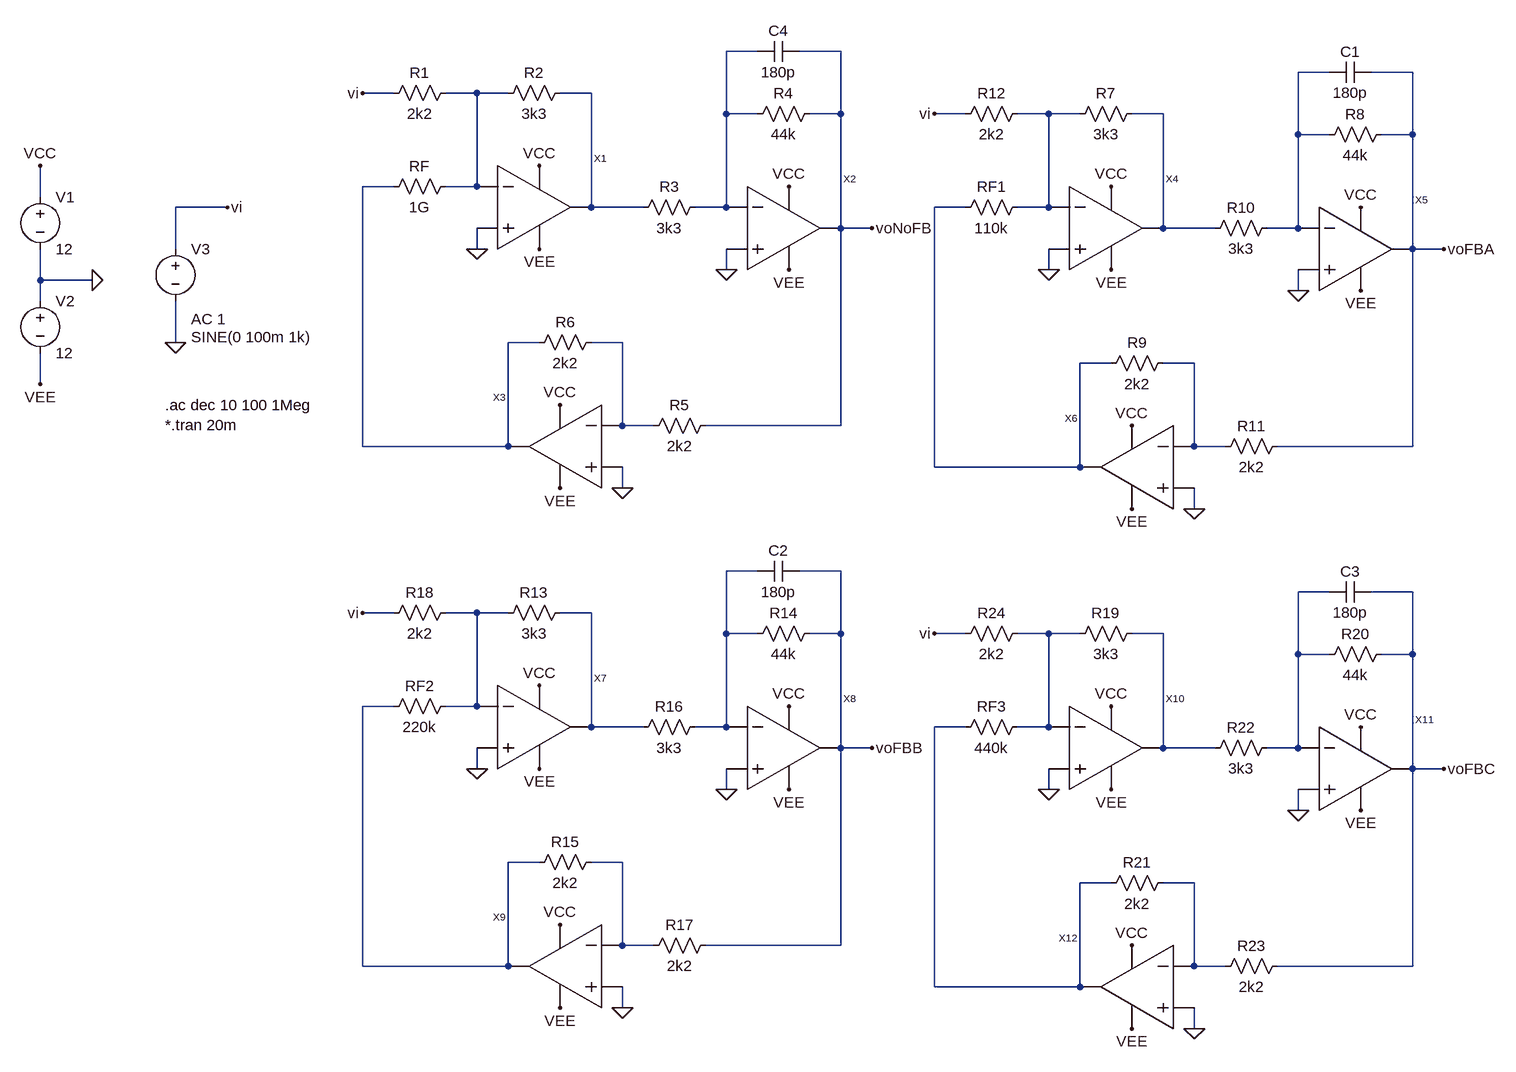
[diagram p0: schematic Perc-02-01-gabung.asc]
Perc-02-01-gabung.asc, the LTspice schematic file:
Version 4
SHEET 1 2268 1400
WIRE 1120 -192 1072 -192
WIRE 1248 -192 1184 -192
WIRE 2000 -160 1952 -160
WIRE 2128 -160 2064 -160
WIRE 560 -128 512 -128
WIRE 688 -128 640 -128
WIRE 736 -128 688 -128
WIRE 864 -128 816 -128
WIRE 1072 -96 1072 -192
WIRE 1120 -96 1072 -96
WIRE 1248 -96 1248 -192
WIRE 1248 -96 1200 -96
WIRE 1440 -96 1392 -96
WIRE 1568 -96 1520 -96
WIRE 1616 -96 1568 -96
WIRE 1744 -96 1696 -96
WIRE 1952 -64 1952 -160
WIRE 2000 -64 1952 -64
WIRE 2128 -64 2128 -160
WIRE 2128 -64 2080 -64
WIRE 560 16 512 16
WIRE 688 16 688 -128
WIRE 688 16 640 16
WIRE 16 32 16 -16
WIRE 304 48 224 48
WIRE 864 48 864 -128
WIRE 944 48 864 48
WIRE 1072 48 1072 -96
WIRE 1072 48 1024 48
WIRE 1440 48 1392 48
WIRE 1568 48 1568 -96
WIRE 1568 48 1520 48
WIRE 1248 80 1248 -96
WIRE 1248 80 1232 80
WIRE 1296 80 1248 80
WIRE 1744 80 1744 -96
WIRE 1824 80 1744 80
WIRE 1952 80 1952 -64
WIRE 1952 80 1904 80
WIRE 224 112 224 48
WIRE 688 112 688 80
WIRE 2128 112 2128 -64
WIRE 2128 112 2112 112
WIRE 2176 112 2128 112
WIRE 1072 144 1072 112
WIRE 1568 144 1568 112
WIRE 16 160 16 112
WIRE 96 160 16 160
WIRE 1952 176 1952 144
WIRE 16 192 16 160
WIRE 224 256 224 192
WIRE 784 256 736 256
WIRE 912 256 864 256
WIRE 1664 288 1616 288
WIRE 1792 288 1744 288
WIRE 16 320 16 272
WIRE 912 384 912 256
WIRE 960 384 912 384
WIRE 1248 384 1248 80
WIRE 1248 384 1040 384
WIRE 512 416 512 16
WIRE 736 416 736 256
WIRE 736 416 512 416
WIRE 1792 416 1792 288
WIRE 1840 416 1792 416
WIRE 2128 416 2128 112
WIRE 2128 416 1920 416
WIRE 1392 448 1392 48
WIRE 1616 448 1616 288
WIRE 1616 448 1392 448
WIRE 912 480 912 448
WIRE 1792 512 1792 480
WIRE 1120 608 1072 608
WIRE 1248 608 1184 608
WIRE 2000 640 1952 640
WIRE 2128 640 2064 640
WIRE 560 672 512 672
WIRE 688 672 640 672
WIRE 736 672 688 672
WIRE 864 672 816 672
WIRE 1072 704 1072 608
WIRE 1120 704 1072 704
WIRE 1248 704 1248 608
WIRE 1248 704 1200 704
WIRE 1440 704 1392 704
WIRE 1568 704 1520 704
WIRE 1616 704 1568 704
WIRE 1744 704 1696 704
WIRE 1952 736 1952 640
WIRE 2000 736 1952 736
WIRE 2128 736 2128 640
WIRE 2128 736 2080 736
WIRE 560 816 512 816
WIRE 688 816 688 672
WIRE 688 816 640 816
WIRE 864 848 864 672
WIRE 944 848 864 848
WIRE 1072 848 1072 704
WIRE 1072 848 1024 848
WIRE 1440 848 1392 848
WIRE 1568 848 1568 704
WIRE 1568 848 1520 848
WIRE 1248 880 1248 704
WIRE 1248 880 1232 880
WIRE 1296 880 1248 880
WIRE 1744 880 1744 704
WIRE 1824 880 1744 880
WIRE 1952 880 1952 736
WIRE 1952 880 1904 880
WIRE 688 912 688 880
WIRE 2128 912 2128 736
WIRE 2128 912 2112 912
WIRE 2176 912 2128 912
WIRE 1072 944 1072 912
WIRE 1568 944 1568 912
WIRE 1952 976 1952 944
WIRE 784 1056 736 1056
WIRE 912 1056 864 1056
WIRE 1664 1088 1616 1088
WIRE 1792 1088 1744 1088
WIRE 912 1184 912 1056
WIRE 960 1184 912 1184
WIRE 1248 1184 1248 880
WIRE 1248 1184 1040 1184
WIRE 512 1216 512 816
WIRE 736 1216 736 1056
WIRE 736 1216 512 1216
WIRE 1792 1216 1792 1088
WIRE 1840 1216 1792 1216
WIRE 2128 1216 2128 912
WIRE 2128 1216 1920 1216
WIRE 1392 1248 1392 848
WIRE 1616 1248 1616 1088
WIRE 1616 1248 1392 1248
WIRE 912 1280 912 1248
WIRE 1792 1312 1792 1280
FLAG 16 -16 VCC
FLAG 16 320 VEE
FLAG 96 160 0
FLAG 784 -16 VCC
FLAG 1168 16 VCC
FLAG 816 352 VCC
FLAG 816 480 VEE
FLAG 784 112 VEE
FLAG 1168 144 VEE
FLAG 688 112 0
FLAG 1072 144 0
FLAG 912 480 0
FLAG 1296 80 voNoFB
FLAG 512 -128 vi
FLAG 304 48 vi
FLAG 224 256 0
FLAG 1664 16 VCC
FLAG 2048 48 VCC
FLAG 1696 384 VCC
FLAG 1696 512 VEE
FLAG 1664 144 VEE
FLAG 2048 176 VEE
FLAG 1568 144 0
FLAG 1952 176 0
FLAG 1792 512 0
FLAG 2176 112 voFBA
FLAG 1392 -96 vi
FLAG 784 784 VCC
FLAG 1168 816 VCC
FLAG 816 1152 VCC
FLAG 816 1280 VEE
FLAG 784 912 VEE
FLAG 1168 944 VEE
FLAG 688 912 0
FLAG 1072 944 0
FLAG 912 1280 0
FLAG 1296 880 voFBB
FLAG 512 672 vi
FLAG 1664 816 VCC
FLAG 2048 848 VCC
FLAG 1696 1184 VCC
FLAG 1696 1312 VEE
FLAG 1664 944 VEE
FLAG 2048 976 VEE
FLAG 1568 944 0
FLAG 1952 976 0
FLAG 1792 1312 0
FLAG 2176 912 voFBC
FLAG 1392 704 vi
SYMBOL voltage 16 16 R0
SYMATTR InstName V1
SYMATTR Value 12
SYMBOL voltage 16 176 R0
SYMATTR InstName V2
SYMATTR Value 12
SYMBOL Opampku 768 48 R0
SYMATTR InstName X1
SYMBOL Opampku 1152 80 R0
SYMATTR InstName X2
SYMBOL Opampku 832 416 M0
SYMATTR InstName X3
SYMBOL res 832 -144 R90
WINDOW 0 0 56 VBottom 2
WINDOW 3 32 56 VTop 2
SYMATTR InstName R2
SYMATTR Value 3k3
SYMBOL res 1216 -112 R90
WINDOW 0 0 56 VBottom 2
WINDOW 3 32 56 VTop 2
SYMATTR InstName R4
SYMATTR Value 44k
SYMBOL res 880 240 R90
WINDOW 0 0 56 VBottom 2
WINDOW 3 32 56 VTop 2
SYMATTR InstName R6
SYMATTR Value 2k2
SYMBOL res 656 0 R90
WINDOW 0 0 56 VBottom 2
WINDOW 3 32 56 VTop 2
SYMATTR InstName RF
SYMATTR Value 1G
SYMBOL res 1040 32 R90
WINDOW 0 0 56 VBottom 2
WINDOW 3 32 56 VTop 2
SYMATTR InstName R3
SYMATTR Value 3k3
SYMBOL res 1056 368 R90
WINDOW 0 0 56 VBottom 2
WINDOW 3 32 56 VTop 2
SYMATTR InstName R5
SYMATTR Value 2k2
SYMBOL res 656 -144 R90
WINDOW 0 0 56 VBottom 2
WINDOW 3 32 56 VTop 2
SYMATTR InstName R1
SYMATTR Value 2k2
SYMBOL cap 1184 -208 R90
WINDOW 0 0 32 VBottom 2
WINDOW 3 32 32 VTop 2
SYMATTR InstName C4
SYMATTR Value 180p
SYMBOL voltage 224 96 R0
WINDOW 3 24 152 Left 2
WINDOW 123 24 124 Left 2
WINDOW 39 0 0 Left 0
SYMATTR Value SINE(0 100m 1k)
SYMATTR Value2 AC 1
SYMATTR InstName V3
SYMBOL Opampku 1648 80 R0
SYMATTR InstName X4
SYMBOL Opampku 2032 112 R0
SYMATTR InstName X5
SYMBOL Opampku 1712 448 M0
SYMATTR InstName X6
SYMBOL res 1712 -112 R90
WINDOW 0 0 56 VBottom 2
WINDOW 3 32 56 VTop 2
SYMATTR InstName R7
SYMATTR Value 3k3
SYMBOL res 2096 -80 R90
WINDOW 0 0 56 VBottom 2
WINDOW 3 32 56 VTop 2
SYMATTR InstName R8
SYMATTR Value 44k
SYMBOL res 1760 272 R90
WINDOW 0 0 56 VBottom 2
WINDOW 3 32 56 VTop 2
SYMATTR InstName R9
SYMATTR Value 2k2
SYMBOL res 1536 32 R90
WINDOW 0 0 56 VBottom 2
WINDOW 3 32 56 VTop 2
SYMATTR InstName RF1
SYMATTR Value 110k
SYMBOL res 1920 64 R90
WINDOW 0 0 56 VBottom 2
WINDOW 3 32 56 VTop 2
SYMATTR InstName R10
SYMATTR Value 3k3
SYMBOL res 1936 400 R90
WINDOW 0 0 56 VBottom 2
WINDOW 3 32 56 VTop 2
SYMATTR InstName R11
SYMATTR Value 2k2
SYMBOL res 1536 -112 R90
WINDOW 0 0 56 VBottom 2
WINDOW 3 32 56 VTop 2
SYMATTR InstName R12
SYMATTR Value 2k2
SYMBOL cap 2064 -176 R90
WINDOW 0 0 32 VBottom 2
WINDOW 3 32 32 VTop 2
SYMATTR InstName C1
SYMATTR Value 180p
SYMBOL Opampku 768 848 R0
SYMATTR InstName X7
SYMBOL Opampku 1152 880 R0
SYMATTR InstName X8
SYMBOL Opampku 832 1216 M0
SYMATTR InstName X9
SYMBOL res 832 656 R90
WINDOW 0 0 56 VBottom 2
WINDOW 3 32 56 VTop 2
SYMATTR InstName R13
SYMATTR Value 3k3
SYMBOL res 1216 688 R90
WINDOW 0 0 56 VBottom 2
WINDOW 3 32 56 VTop 2
SYMATTR InstName R14
SYMATTR Value 44k
SYMBOL res 880 1040 R90
WINDOW 0 0 56 VBottom 2
WINDOW 3 32 56 VTop 2
SYMATTR InstName R15
SYMATTR Value 2k2
SYMBOL res 656 800 R90
WINDOW 0 0 56 VBottom 2
WINDOW 3 32 56 VTop 2
SYMATTR InstName RF2
SYMATTR Value 220k
SYMBOL res 1040 832 R90
WINDOW 0 0 56 VBottom 2
WINDOW 3 32 56 VTop 2
SYMATTR InstName R16
SYMATTR Value 3k3
SYMBOL res 1056 1168 R90
WINDOW 0 0 56 VBottom 2
WINDOW 3 32 56 VTop 2
SYMATTR InstName R17
SYMATTR Value 2k2
SYMBOL res 656 656 R90
WINDOW 0 0 56 VBottom 2
WINDOW 3 32 56 VTop 2
SYMATTR InstName R18
SYMATTR Value 2k2
SYMBOL cap 1184 592 R90
WINDOW 0 0 32 VBottom 2
WINDOW 3 32 32 VTop 2
SYMATTR InstName C2
SYMATTR Value 180p
SYMBOL Opampku 1648 880 R0
SYMATTR InstName X10
SYMBOL Opampku 2032 912 R0
SYMATTR InstName X11
SYMBOL Opampku 1712 1248 M0
SYMATTR InstName X12
SYMBOL res 1712 688 R90
WINDOW 0 0 56 VBottom 2
WINDOW 3 32 56 VTop 2
SYMATTR InstName R19
SYMATTR Value 3k3
SYMBOL res 2096 720 R90
WINDOW 0 0 56 VBottom 2
WINDOW 3 32 56 VTop 2
SYMATTR InstName R20
SYMATTR Value 44k
SYMBOL res 1760 1072 R90
WINDOW 0 0 56 VBottom 2
WINDOW 3 32 56 VTop 2
SYMATTR InstName R21
SYMATTR Value 2k2
SYMBOL res 1536 832 R90
WINDOW 0 0 56 VBottom 2
WINDOW 3 32 56 VTop 2
SYMATTR InstName RF3
SYMATTR Value 440k
SYMBOL res 1920 864 R90
WINDOW 0 0 56 VBottom 2
WINDOW 3 32 56 VTop 2
SYMATTR InstName R22
SYMATTR Value 3k3
SYMBOL res 1936 1200 R90
WINDOW 0 0 56 VBottom 2
WINDOW 3 32 56 VTop 2
SYMATTR InstName R23
SYMATTR Value 2k2
SYMBOL res 1536 688 R90
WINDOW 0 0 56 VBottom 2
WINDOW 3 32 56 VTop 2
SYMATTR InstName R24
SYMATTR Value 2k2
SYMBOL cap 2064 624 R90
WINDOW 0 0 32 VBottom 2
WINDOW 3 32 32 VTop 2
SYMATTR InstName C3
SYMATTR Value 180p
TEXT 208 352 Left 2 !.ac dec 10 100 1Meg\n*.tran 20m

The netlist it stands for:
* Perc-02-01-gabung.asc
V1 VCC 0 12
V2 0 VEE 12
XX1 N003 0 VCC VEE N004 Opampku  ; pins inn inp vp vn out
XX2 N001 0 VCC VEE voNoFB Opampku  ; pins inn inp vp vn out
XX3 N009 0 VCC VEE N007 Opampku  ; pins inn inp vp vn out
R2 N004 N003 3k3
R4 voNoFB N001 44k
R6 N009 N007 2k2
RF N003 N007 1G
R3 N001 N004 3k3
R5 voNoFB N009 2k2
R1 N003 vi 2k2
C4 voNoFB N001 180p
V3 vi 0 SINE(0 100m 1k) AC 1
XX4 N005 0 VCC VEE N006 Opampku  ; pins inn inp vp vn out
XX5 N002 0 VCC VEE voFBA Opampku  ; pins inn inp vp vn out
XX6 N010 0 VCC VEE N008 Opampku  ; pins inn inp vp vn out
R7 N006 N005 3k3
R8 voFBA N002 44k
R9 N010 N008 2k2
RF1 N005 N008 110k
R10 N002 N006 3k3
R11 voFBA N010 2k2
R12 N005 vi 2k2
C1 voFBA N002 180p
XX7 N013 0 VCC VEE N014 Opampku  ; pins inn inp vp vn out
XX8 N011 0 VCC VEE voFBB Opampku  ; pins inn inp vp vn out
XX9 N019 0 VCC VEE N017 Opampku  ; pins inn inp vp vn out
R13 N014 N013 3k3
R14 voFBB N011 44k
R15 N019 N017 2k2
RF2 N013 N017 220k
R16 N011 N014 3k3
R17 voFBB N019 2k2
R18 N013 vi 2k2
C2 voFBB N011 180p
XX10 N015 0 VCC VEE N016 Opampku  ; pins inn inp vp vn out
XX11 N012 0 VCC VEE voFBC Opampku  ; pins inn inp vp vn out
XX12 N020 0 VCC VEE N018 Opampku  ; pins inn inp vp vn out
R19 N016 N015 3k3
R20 voFBC N012 44k
R21 N020 N018 2k2
RF3 N015 N018 440k
R22 N012 N016 3k3
R23 voFBC N020 2k2
R24 N015 vi 2k2
C3 voFBC N012 180p
.ac dec 10 100 1Meg
*.tran 20m
.backanno
.end